# Altium schematic sheet Block Diagram.SchDoc
size A4; Date: 08-May-2020; ApprovedBy: Vijay; CheckedBy: Vijay; CompanyName: Embdes Engineering Solutions Pvt. Ltd.; DrawnBy: Sandeep G; Organization: Altium Limited; Address1: e2-s.com; DocumentNumber: ECG_BLE.PCBA; Revision: Rev1.0; SheetNumber: 1; SheetTotal: 4; ApprovedByDate: <DATE>; CheckedByDate: <DATE>; DrawnByDate: <DATE>; PageName: Block Diagram; PageSetup: Record=PageOptions|CenterHorizontal=True|CenterVertical=True|PrintScale=0.71|XCorrection=1.00|YCorrection=1.00|PrintKind=1|BorderSize=5000000|LeftOffset=0|BottomOffset=0|Orientation=2|PaperLength=1000|PaperWidth=1000|Scale=100|PaperSource=15|PrintQuality=-4|MediaType=1|DitherType=10|PaperKind=Ledger.|PrintScaleMode=1; ProjectName: <Project Name>
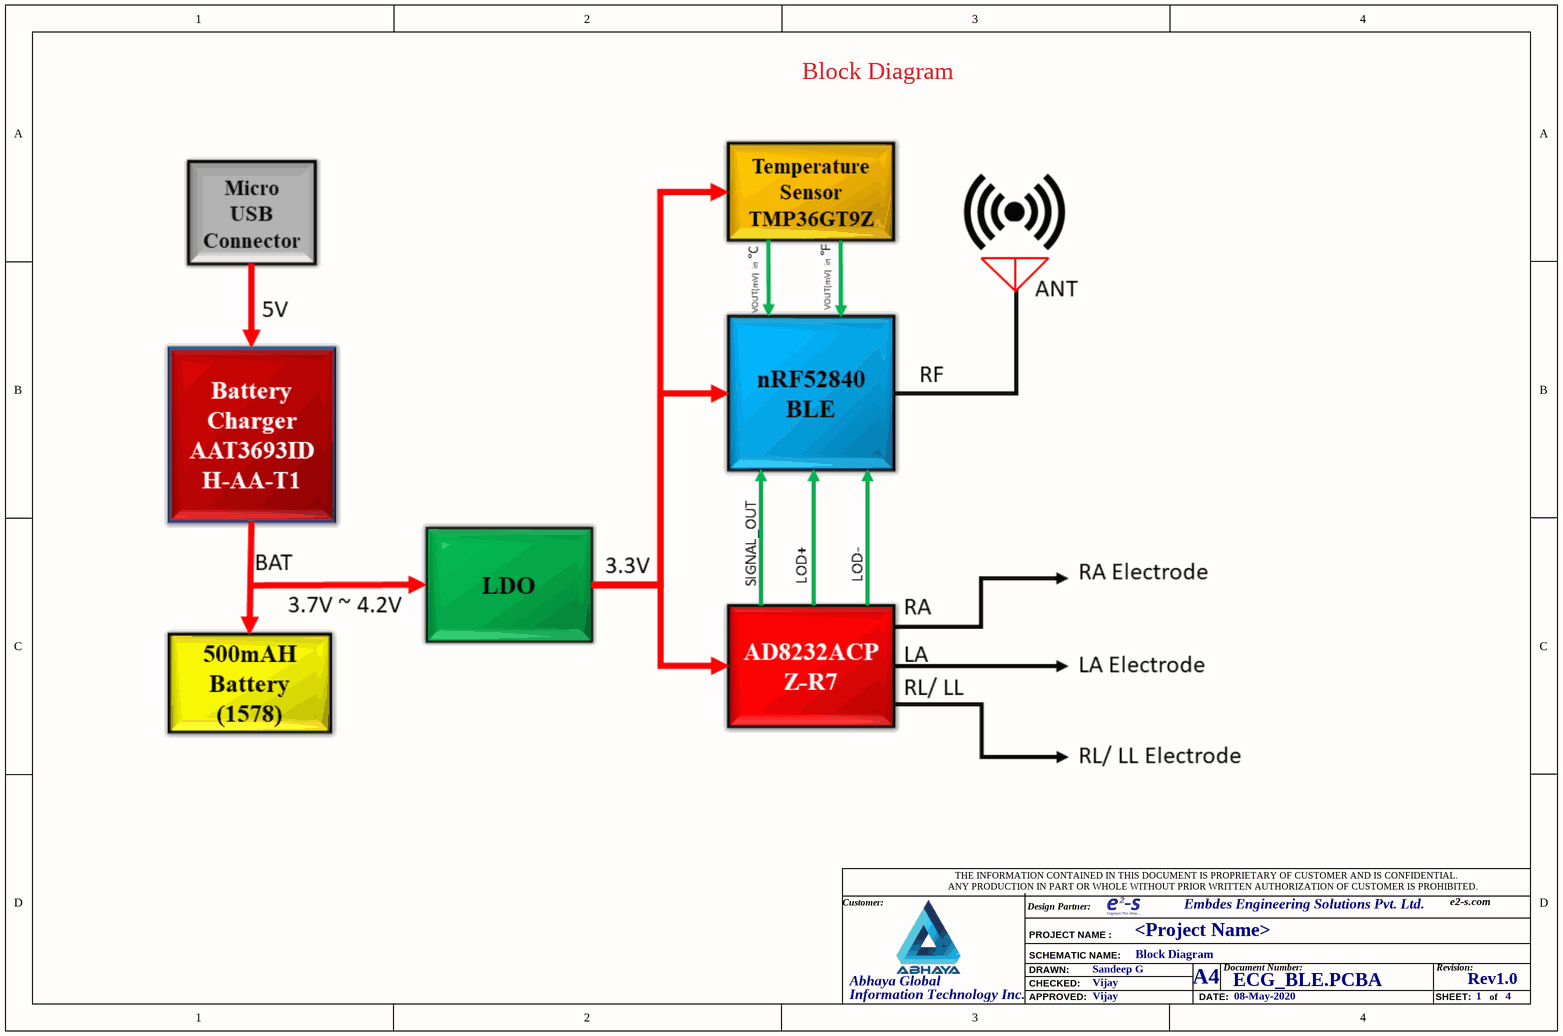
[diagram p0: Block Diagram.SchDoc]

## Notes on the sheet
- Block Diagram
- Customer:
- Design Partner:
- THE INFORMATION CONTAINED IN THIS DOCUMENT IS PROPRIETARY OF CUSTOMER AND IS CONFIDENTIAL.
- ANY PRODUCTION IN PART OR WHOLE WITHOUT PRIOR WRITTEN AUTHORIZATION OF CUSTOMER IS PROHIBITED.
- Abhaya Global
- DRAWN:
- CHECKED:
- PROJECT NAME :
- SCHEMATIC NAME:
- A4
- Document Number:
- Revision:
- Information Technology Inc.
- APPROVED:
- DATE:
- SHEET:
- of